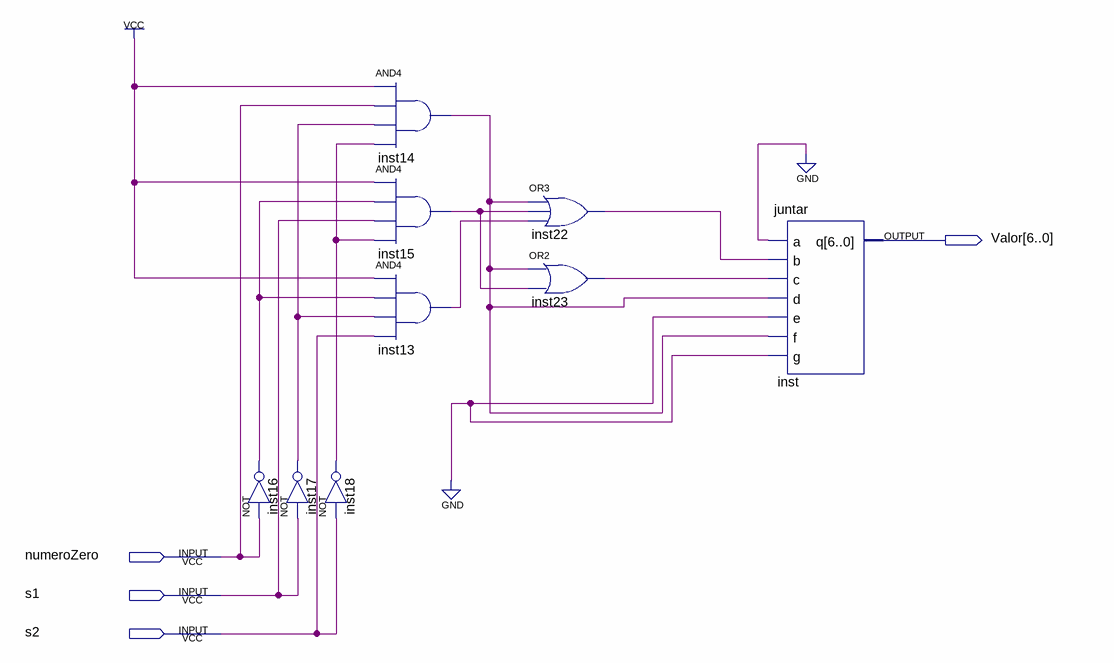
[diagram p0: schematic sheet]
// Quartus schematic ValorSoma.bdf as structural Verilog: 9 symbols, 4 pins
module ValorSoma (
  input  numeroZero,
  input  s1,
  input  s2,
  output [6:0] Valor
);

  wire inst13_out, inst14_out, inst15_out, inst16_out, inst17_out, inst18_out, inst22_out, inst23_out;

  not inst16 (inst16_out, numeroZero);
  not inst17 (inst17_out, s1);
  and inst14 (inst14_out, 1'b1, numeroZero, inst17_out, inst18_out);
  and inst15 (inst15_out, 1'b1, inst16_out, s1, inst18_out);
  and inst13 (inst13_out, 1'b1, inst16_out, inst17_out, s2);
  not inst18 (inst18_out, s2);
  or inst22 (inst22_out, inst14_out, inst15_out, inst13_out);
  or inst23 (inst23_out, inst14_out, inst15_out);
  juntar inst (.a(1'b0), .b(inst22_out), .c(inst23_out), .d(inst14_out), .e(1'b0), .f(inst14_out), .g(1'b0), .q(Valor));
endmodule
